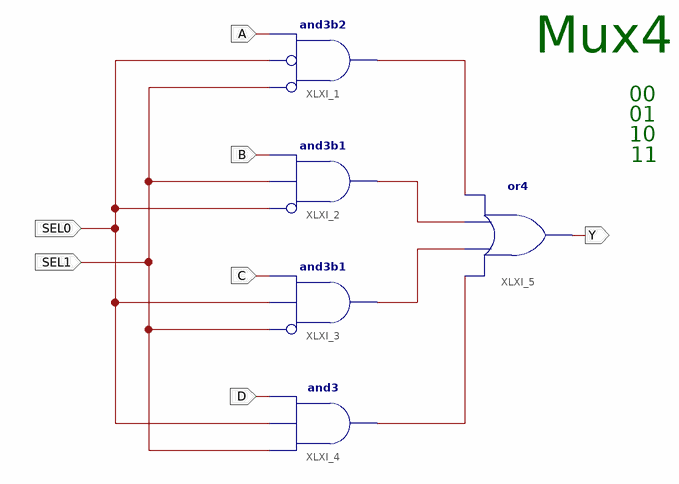
[diagram p0: schematic sheet 1]
// Xilinx ISE schematic mux4.sch (spartan6) as structural Verilog: 5 symbols, 7 ports
module mux4 (
  input  SEL0,
  input  SEL1,
  input  A,
  input  B,
  input  C,
  input  D,
  output Y
);

  wire XLXN_13, XLXN_14, XLXN_15, XLXN_16;

  and XLXI_1 (XLXN_13, ~SEL1, ~SEL0, A);  // and3b2
  and XLXI_2 (XLXN_14, ~SEL0, SEL1, B);  // and3b1
  and XLXI_3 (XLXN_15, ~SEL1, SEL0, C);  // and3b1
  and XLXI_4 (XLXN_16, SEL1, SEL0, D);
  or XLXI_5 (Y, XLXN_16, XLXN_15, XLXN_14, XLXN_13);

  // Notes on the sheet:
  //   Mux4
  //   00
  //   01
  //   10
  //   11
endmodule
